# Altium schematic sheet Top Level.SchDoc
size A4; SheetNumber: 1; SheetTotal: 5
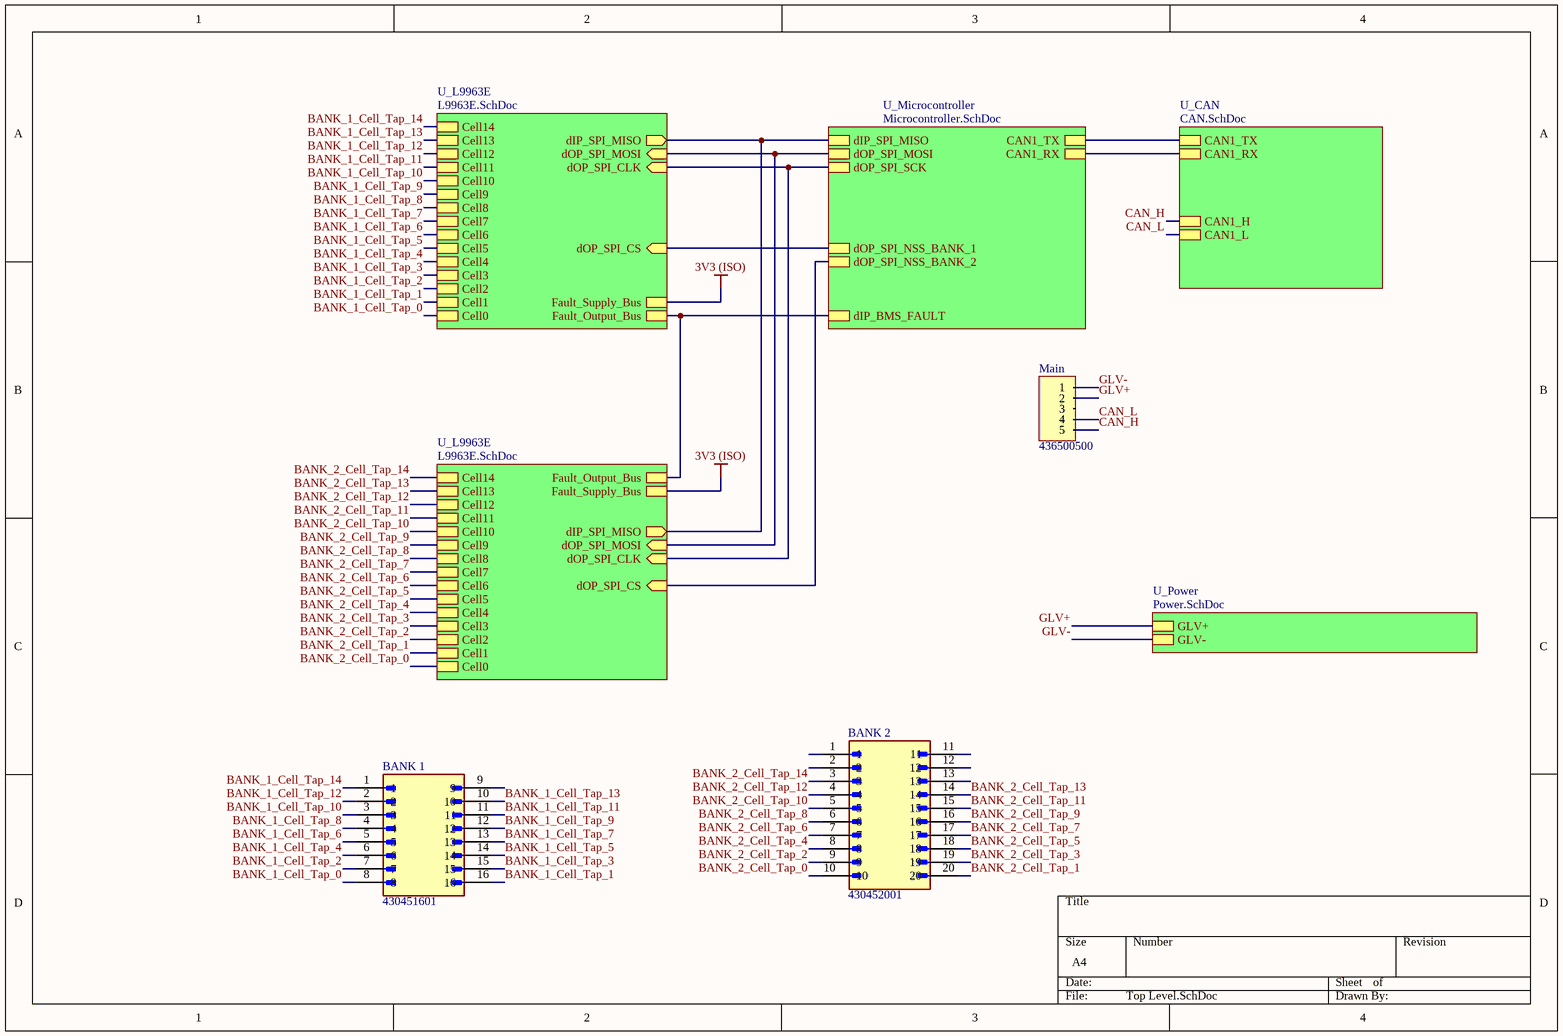
[diagram p0: Top Level.SchDoc]

## Parts
BANK_1  430451601  [430451601]
BANK_2  430452001  [430452001]
Main  436500500  [436500500]

## Sub-sheets
U_CAN = CAN.SchDoc: CAN1_H, CAN1_L, CAN1_TX, CAN1_RX
U_L9963E = L9963E.SchDoc: Cell14, Cell13, Cell12, Cell11, Cell10, Cell9, Cell8, Cell7, Cell6, Cell5, Cell4, Cell3, Cell2, Cell1, Cell0, dOP_SPI_CS (in), dOP_SPI_CLK (in), dOP_SPI_MOSI (in), dIP_SPI_MISO (out), Fault_Supply_Bus, Fault_Output_Bus
U_L9963E = L9963E.SchDoc: Cell14, Cell13, Cell12, Cell11, Cell10, Cell9, Cell8, Cell7, Cell6, Cell5, Cell4, Cell3, Cell2, Cell1, Cell0, dOP_SPI_CS (in), dOP_SPI_CLK (in), dOP_SPI_MOSI (in), dIP_SPI_MISO (out), Fault_Supply_Bus, Fault_Output_Bus
U_Microcontroller = Microcontroller.SchDoc: CAN1_RX, CAN1_TX, dIP_SPI_MISO, dOP_SPI_MOSI, dOP_SPI_SCK, dOP_SPI_NSS_BANK_1, dOP_SPI_NSS_BANK_2, dIP_BMS_FAULT
U_Power = Power.SchDoc: GLV+, GLV-

## Nets
3V3 (ISO): sheet U_L9963E/Fault_Supply_Bus, sheet U_L9963E/Fault_Supply_Bus
BANK_1_Cell_Tap_0: BANK_1.8 ; sheet U_L9963E/Cell0
BANK_1_Cell_Tap_1: BANK_1.16 ; sheet U_L9963E/Cell1
BANK_1_Cell_Tap_2: BANK_1.7 ; sheet U_L9963E/Cell2
BANK_1_Cell_Tap_3: BANK_1.15 ; sheet U_L9963E/Cell3
BANK_1_Cell_Tap_4: BANK_1.6 ; sheet U_L9963E/Cell4
BANK_1_Cell_Tap_5: BANK_1.14 ; sheet U_L9963E/Cell5
BANK_1_Cell_Tap_6: BANK_1.5 ; sheet U_L9963E/Cell6
BANK_1_Cell_Tap_7: BANK_1.13 ; sheet U_L9963E/Cell7
BANK_1_Cell_Tap_8: BANK_1.4 ; sheet U_L9963E/Cell8
BANK_1_Cell_Tap_9: BANK_1.12 ; sheet U_L9963E/Cell9
BANK_1_Cell_Tap_10: BANK_1.3 ; sheet U_L9963E/Cell10
BANK_1_Cell_Tap_11: BANK_1.11 ; sheet U_L9963E/Cell11
BANK_1_Cell_Tap_12: BANK_1.2 ; sheet U_L9963E/Cell12
BANK_1_Cell_Tap_13: BANK_1.10 ; sheet U_L9963E/Cell13
BANK_1_Cell_Tap_14: BANK_1.1 ; sheet U_L9963E/Cell14
BANK_2_Cell_Tap_0: BANK_2.10 ; sheet U_L9963E/Cell0
BANK_2_Cell_Tap_1: BANK_2.20 ; sheet U_L9963E/Cell1
BANK_2_Cell_Tap_2: BANK_2.9 ; sheet U_L9963E/Cell2
BANK_2_Cell_Tap_3: BANK_2.19 ; sheet U_L9963E/Cell3
BANK_2_Cell_Tap_4: BANK_2.8 ; sheet U_L9963E/Cell4
BANK_2_Cell_Tap_5: BANK_2.18 ; sheet U_L9963E/Cell5
BANK_2_Cell_Tap_6: BANK_2.7 ; sheet U_L9963E/Cell6
BANK_2_Cell_Tap_7: BANK_2.17 ; sheet U_L9963E/Cell7
BANK_2_Cell_Tap_8: BANK_2.6 ; sheet U_L9963E/Cell8
BANK_2_Cell_Tap_9: BANK_2.16 ; sheet U_L9963E/Cell9
BANK_2_Cell_Tap_10: BANK_2.5 ; sheet U_L9963E/Cell10
BANK_2_Cell_Tap_11: BANK_2.15 ; sheet U_L9963E/Cell11
BANK_2_Cell_Tap_12: BANK_2.4 ; sheet U_L9963E/Cell12
BANK_2_Cell_Tap_13: BANK_2.14 ; sheet U_L9963E/Cell13
BANK_2_Cell_Tap_14: BANK_2.3 ; sheet U_L9963E/Cell14
CAN_H: Main.5 ; sheet U_CAN/CAN1_H
CAN_L: Main.4 ; sheet U_CAN/CAN1_L
GLV+: Main.2 ; sheet U_Power/GLV+
GLV-: Main.1 ; sheet U_Power/GLV-
(unnamed): sheet U_Microcontroller/CAN1_RX, sheet U_CAN/CAN1_RX
(unnamed): sheet U_Microcontroller/CAN1_TX, sheet U_CAN/CAN1_TX
(unnamed): sheet U_Microcontroller/dIP_SPI_MISO, sheet U_L9963E/dIP_SPI_MISO, sheet U_L9963E/dIP_SPI_MISO
(unnamed): sheet U_Microcontroller/dOP_SPI_MOSI, sheet U_L9963E/dOP_SPI_MOSI, sheet U_L9963E/dOP_SPI_MOSI
(unnamed): sheet U_Microcontroller/dOP_SPI_SCK, sheet U_L9963E/dOP_SPI_CLK, sheet U_L9963E/dOP_SPI_CLK
(unnamed): sheet U_Microcontroller/dOP_SPI_NSS_BANK_1, sheet U_L9963E/dOP_SPI_CS
(unnamed): sheet U_Microcontroller/dOP_SPI_NSS_BANK_2, sheet U_L9963E/dOP_SPI_CS
(unnamed): sheet U_Microcontroller/dIP_BMS_FAULT, sheet U_L9963E/Fault_Output_Bus, sheet U_L9963E/Fault_Output_Bus

Not connected (* = marked no-connect by the designer): BANK_1 9; BANK_2 1 2 11 12 13; Main 3

## Library data of the parts
BANK_1 = 430451601: Micro-Fit 8x2 TH R/A; Positions: 16; Pitch: 3.0mm; Angle: 90; Flange: No; Contact: Gold; Price: None; Availability: Unavailable; Package: None; MP: 430451601; Value: *; Part Number: 430451601; Row Spacing: 3.0mm; Digikey Part Number: WM7490-ND; Digikey Link: https://www.digikey.com.au/en/products/detail/molex/0430451601/3044582
BANK_2 = 430452001: Micro-Fit 10x2 TH R/A; Positions: 20; Pitch: 3.0mm; Angle: 90; Flange: No; Contact: Gold; MP: 430452001; Package: None; Price: None; Availability: Unavailable; Value: *; Part Number: 430452001; Row Spacing: 3.0mm; Digikey Part Number: WM7492-ND; Digikey Link: https://www.digikey.com.au/en/products/detail/molex/0430452001/3044584
Main = 436500500: Micro-Fit 5x1; Positions: 5; Pitch: 3.0mm; Angle: 90; Flange: No; Contact: Tin; Part Number: 436500500; Row Spacing: 3.0mm; Digikey Part Number: WM1863-ND; Digikey Link: https://www.digikey.com.au/en/products/detail/molex/0436500500/268992